# Altium schematic sheet MotherBoard.SchDoc
size A3; SheetNumber: 2; SheetTotal: 2
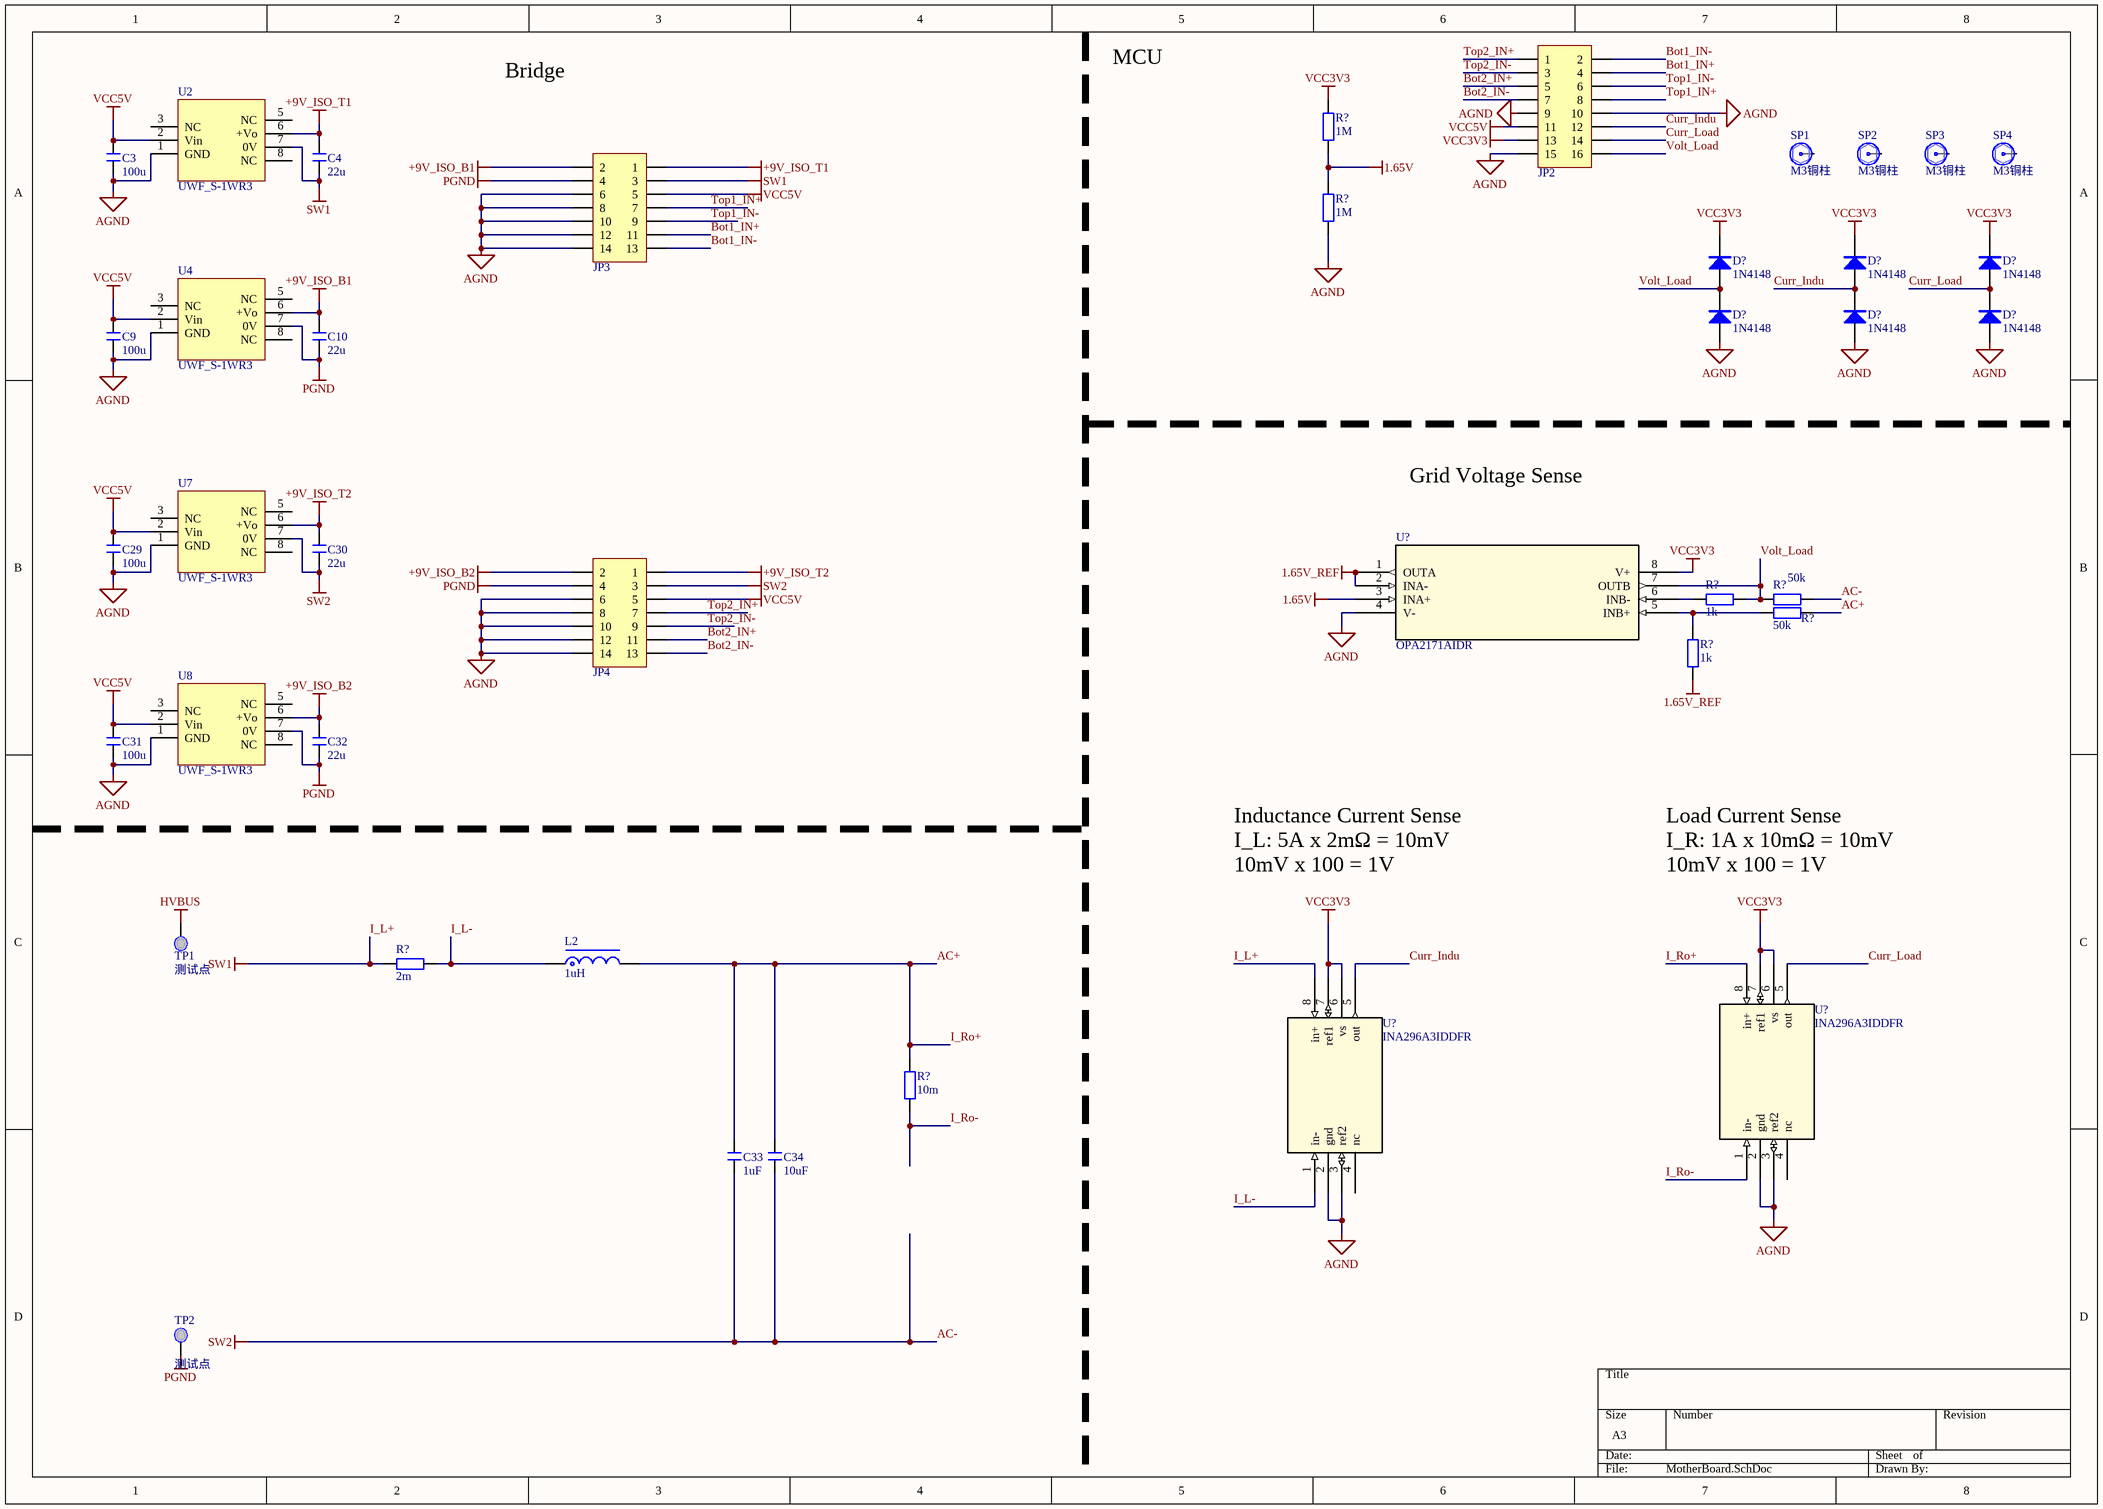
[diagram p0: MotherBoard.SchDoc]

## Parts
(Parts that share a designator on the sheet are numbered #1, #2 ... from top to bottom, then left to right.)
C3  100u  [C 0805_L]
C4  22u  [C 0603_L]
C9  100u  [C 0805_L]
C10  22u  [C 0603_L]
C29  100u  [C 0805_L]
C30  22u  [C 0603_L]
C31  100u  [C 0805_L]
C32  22u  [C 0603_L]
C33  1uF  [C 1206_L]
C34  10uF  [C 1210_L]
D?#1  1N4148  [SOD-323]
D?#2  1N4148  [SOD-323]
D?#3  1N4148  [SOD-323]
D?#4  1N4148  [SOD-323]
D?#5  1N4148  [SOD-323]
D?#6  1N4148  [SOD-323]
JP2  Header 8X2  [HDR2.54-LI-2x8P]  (value not drawn)
JP3  Header 2X7  [HDR2.54-LI-2x7P]  (value not drawn)
JP4  Header 2X7  [HDR2.54-LI-2x7P]  (value not drawn)
L2  1uH  [CD43]
R?#1  1M  [R 0603_L]
R?#2  1M  [R 0603_L]
R?#3  1k  [R 0603_L]
R?#4  50k  [R 0603_L]
R?#5  50k  [R 0603_L]
R?#6  1k  [R 0603_L]
R?#7  2m  [R 2512_M]
R?#8  10m  [R 2512_M]
SP1  M3铜柱  [M3x7+6_N]
SP2  M3铜柱  [M3x7+6_N]
SP3  M3铜柱  [M3x7+6_N]
SP4  M3铜柱  [M3x7+6_N]
TP1  测试点  [tp32]
TP2  测试点  [tp32]
U2  UWF_S-1WR3  [UWF_S-1WR3]
U4  UWF_S-1WR3  [UWF_S-1WR3]
U7  UWF_S-1WR3  [UWF_S-1WR3]
U8  UWF_S-1WR3  [UWF_S-1WR3]
U?#1  OPA2171AIDR  [D8]
U?#2  INA296A3IDDFR  [SOT23_DDF_TEX]
U?#3  INA296A3IDDFR  [SOT23_DDF_TEX]

## Nets
1.65V: R?#1.1 R?#2.2 U?#1.3(INA+)
1.65V_REF: R?#6.2 U?#1.1(OUTA) U?#1.2(INA-)
+9V_ISO_B1: C10.2 JP3.2 U4.6(+Vo)
+9V_ISO_B2: C32.2 JP4.2 U8.6(+Vo)
+9V_ISO_T1: C4.2 JP3.1 U2.6(+Vo)
+9V_ISO_T2: C30.2 JP4.1 U7.6(+Vo)
AC-: C30.1 C33.1 C34.1 JP4.3 R?#4.2 U7.7(0V)  [also labelled SW2]
AGND: C3.1 C9.1 C29.1 C31.1 D?#4.1(A) D?#5.1(A) D?#6.1(A) JP2.9 JP2.10 JP2.15 JP3.6 JP3.8 JP3.10 JP3.12 JP3.14 JP4.6 JP4.8 JP4.10 JP4.12 JP4.14 R?#2.1 U2.1(GND) U4.1(GND) U7.1(GND) U8.1(GND) U?#1.4(V-) U?#2.2(gnd) U?#2.3(ref2) U?#3.2(gnd) U?#3.3(ref2)
HVBUS: TP1.1
I_L+: C4.1 JP3.3 R?#7.2 U2.7(0V) U?#3.8(in+)  [also labelled SW1]
PGND: C10.1 C32.1 JP3.4 JP4.4 TP2.1 U4.7(0V) U8.7(0V)
VCC3V3: D?#1.2(K) D?#2.2(K) D?#3.2(K) JP2.13 R?#1.2 U?#1.8(V+) U?#2.6(vs) U?#2.7(ref1) U?#3.6(vs) U?#3.7(ref1)
VCC5V: C3.2 C9.2 C29.2 C31.2 JP2.11 JP3.5 JP4.5 U2.2(Vin) U4.2(Vin) U7.2(Vin) U8.2(Vin)
AC+: C33.2 C34.2 L2.2 R?#5.2 R?#8.2 U?#2.8(in+)  [also labelled I_Ro+]
Bot1_IN+: JP2.4 JP3.11
Bot1_IN-: JP2.2 JP3.13
Bot2_IN+: JP2.5 JP4.11
Bot2_IN-: JP2.7 JP4.13
Curr_Indu: D?#2.1(A) D?#5.2(K) JP2.12 U?#3.5(out)
Curr_Load: D?#3.1(A) D?#6.2(K) JP2.14 U?#2.5(out)
I_L-: L2.1 R?#7.1 U?#3.1(in-)
I_Ro-: R?#8.1 U?#2.1(in-)
Top1_IN+: JP2.8 JP3.7
Top1_IN-: JP2.6 JP3.9
Top2_IN+: JP2.1 JP4.7
Top2_IN-: JP2.3 JP4.9
Volt_Load: D?#1.1(A) D?#4.2(K) JP2.16 R?#3.1 R?#4.1 U?#1.7(OUTB)
NetR?#3_2: R?#3.2 U?#1.6(INB-)
NetR?#5_1: R?#5.1 R?#6.1 U?#1.5(INB+)

Not connected (* = marked no-connect by the designer): SP1 1; SP2 1; SP3 1; SP4 1; U2 3(NC) 5(NC) 8(NC); U4 3(NC) 5(NC) 8(NC); U7 3(NC) 5(NC) 8(NC); U8 3(NC) 5(NC) 8(NC); U?#2 4(nc); U?#3 4(nc)

## Notes on the sheet
- Bridge
- (near R?#1) MCU
- Grid Voltage Sense
  ±50V / 50 = ± 1V
- Inductance Current Sense
  I_L: 5A x 2mΩ = 10mV
  10mV x 100 = 1V
- Load Current Sense
  I_R: 1A x 10mΩ = 10mV
  10mV x 100 = 1V

## Library data of the parts
C3 C4 C9 C10 C29-C34 = C: 无极性贴片电容; 版权归属: 源创客; 材质: X7R; BOM名称: 无极性贴片电容; 学习资源: www.ooocke.com
D?#1-D?#6 = 1N4148: 高速开关二极管; 版权归属: 源创客; BOM名称: 高速开关二极管; 学习资源: www.ooocke.com
JP2 = Header 8X2: 8*2P接插件; 版权归属: 源创客; BOM名称: 8*2P接插件; 学习资源: www.ooocke.com
JP3 JP4 = Header 7X2: 7*2P接插件; 版权归属: 源创客; BOM名称: 7*2P接插件; 学习资源: www.ooocke.com
L2 = L-CD: 贴片功率电感; BOM名称: 功率电感; 版权归属: 源创客; 学习资源: www.ooocke.com
R?#1-R?#8 = R: 贴片电阻; 版权归属: 源创客; BOM名称: 贴片电阻; 学习资源: www.ooocke.com
SP1-SP4 = 铜柱加头大焊盘: 铜柱; 版权归属: 源创客; BOM名称: 铜柱; 学习资源: www.ooocke.com
TP1 TP2 = TestPoint: 元件描述: 电源和信号测试点; 贴片和直插: 机械组装; 是否安装: 否; Value: 测试点
U?#1 = OPA2171AIDR: No Description Available; Mfr_Name: Texas Instruments; RefDes: RefDes; Type: Type
U?#2 U?#3 = INA296A3IDDFR: No Description Available; Mfr_Name: Texas Instruments; Type: Linear; RefDes: RefDes